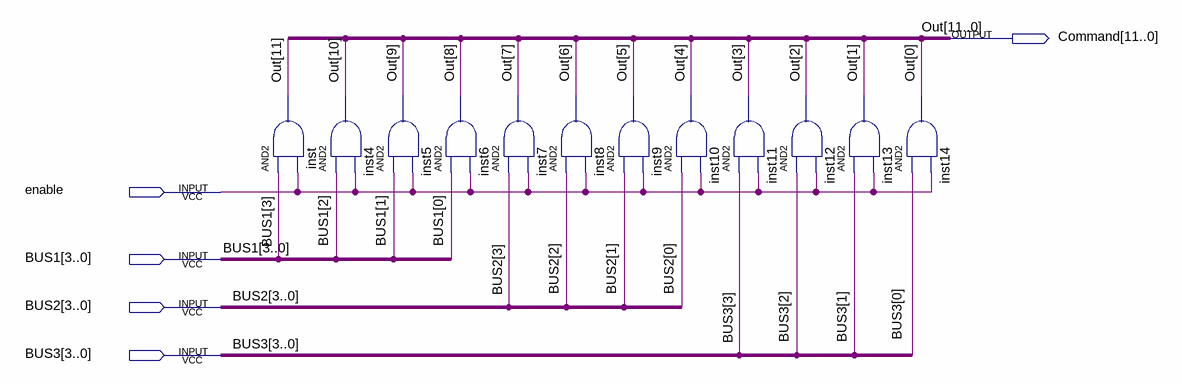
[diagram p0: schematic sheet]
// Quartus schematic CommandAdapter.bdf as structural Verilog: 12 symbols, 5 pins
module CommandAdapter (
  input  enable,
  input  [3:0] BUS1,
  input  [3:0] BUS2,
  input  [3:0] BUS3,
  output [11:0] Command
);

  and inst (Command[11], BUS1[3], enable);
  and inst4 (Command[10], BUS1[2], enable);
  and inst5 (Command[9], BUS1[1], enable);
  and inst6 (Command[8], BUS1[0], enable);
  and inst7 (Command[7], BUS2[3], enable);
  and inst8 (Command[6], BUS2[2], enable);
  and inst9 (Command[5], BUS2[1], enable);
  and inst10 (Command[4], BUS2[0], enable);
  and inst11 (Command[3], BUS3[3], enable);
  and inst12 (Command[2], BUS3[2], enable);
  and inst13 (Command[1], BUS3[1], enable);
  and inst14 (Command[0], BUS3[0], enable);

  // Other names for the same wires on the sheet: Out[11:0] = Command
endmodule
